# Altium schematic sheet Display.SchDoc
size A; SheetNumber: 4; SheetTotal: 4
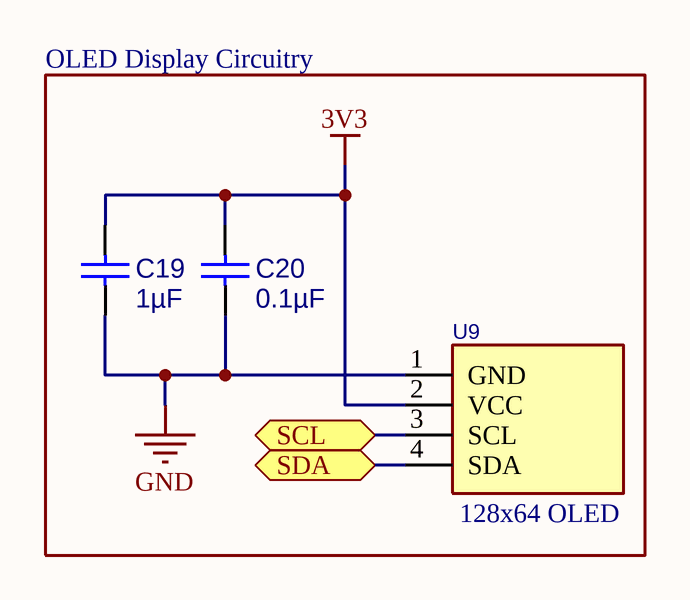
[diagram p0: Display.SchDoc]

## Parts
C19  1µF  [WCAP-CSGP_0603_L1.6W0.8H0.8_Reflow]
C20  0.1µF  [WCAP-CSGP_0603_L1.6W0.8H0.8_Reflow]
U9  128x64 OLED  [Amazon OLED Display Module]

## Blocks framed on the sheet
OLED Display Circuitry: C19 C20 U9

## Ports
SCL (bidir, see ICs[2C], ICs[3B], ICs[4B], ICs[4C], Microcontroller[3A]), SDA (bidir, see ICs[2C], ICs[3B], ICs[4B], ICs[4C], Microcontroller[3A])

## Nets
3V3: C19.2 C20.2 U9.2(VCC)
GND: C19.1 C20.1 U9.1(GND)
SCL: U9.3(SCL) ; port SCL
SDA: U9.4(SDA) ; port SDA

## Library data of the parts
C19 C20 = CMP-207839-000060-3: 10V tolerance
U9 = CMP-00256-A.5: Hosyond 5 Pcs 0.96 Inch OLED I2C Display Module 128x64 Pixel OLED Display; Amazon Link: https://www.amazon.com/dp/B09C5K91H7?ref=ppx_yo2ov_dt_b_product_details&th=1; Parameter 1: *